# Altium project PowerBoard.PrjPcb
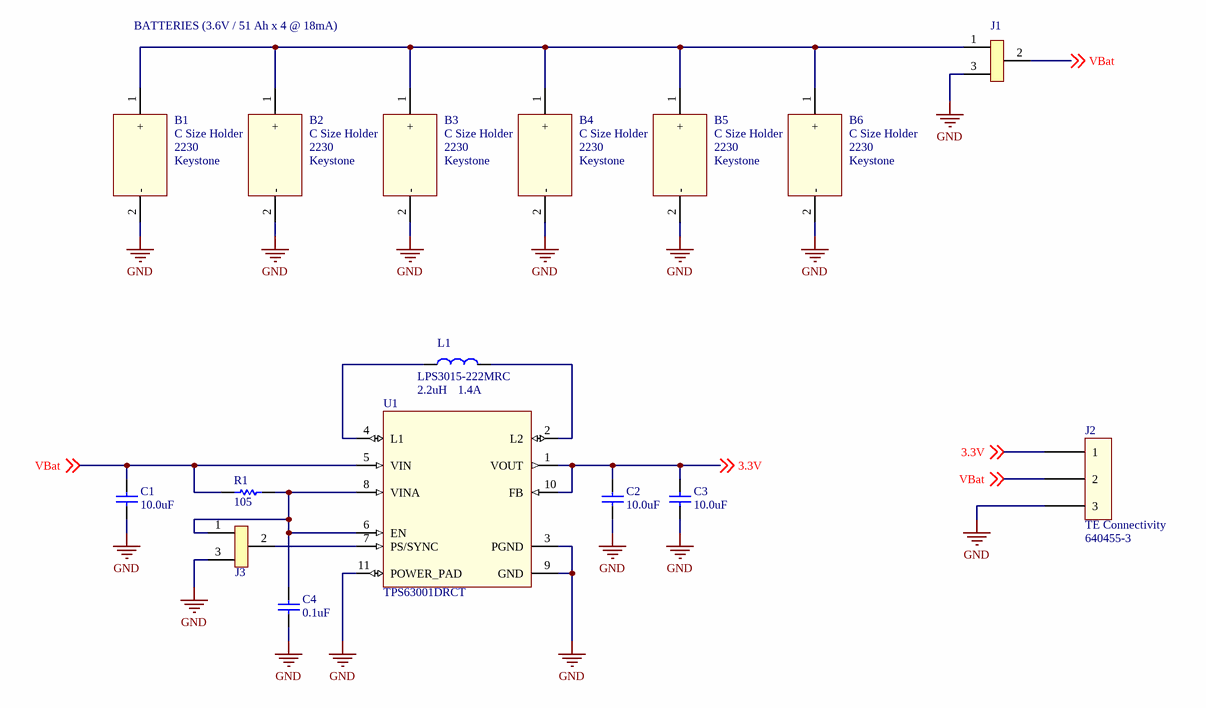
[diagram p0: Power.SchDoc]
1 sheet, 16 parts. Net scope: global (net labels, ports and power ports of the same name join across sheets).
Board file: PowerBoard.PcbDoc

## Sheet Power.SchDoc: POWER
size A4; Author: MOG; CompanyName: GIE GROUP; DrawnBy: MOG; Organization: Gie SA; Address1: Galicia 52; Address2: Mar del Plata; Address3: Buenos Aires; Address4: Argentina; DocumentNumber: 1; Revision: 0.0; SheetNumber: 1; SheetTotal: 1; Project: CP DATALOGGER; PageSetup: Record=PageOptions|CenterHorizontal=True|CenterVertical=True|PrintScale=0.94|XCorrection=1.00|YCorrection=1.00|PrintKind=0|BorderSize=5000000|LeftOffset=0|BottomOffset=0|Orientation=2|PaperLength=1000|PaperWidth=1000|Scale=100|PaperSource=7|PrintQuality=720|MediaType=1|DitherType=10|PaperKind=A4|PrintScaleMode=1

### Parts
B1  value C Size Holder  Manufacturer: Keystone  [KEYSTONE-2230]  (hidden comment: 2230)
B2  value C Size Holder  Manufacturer: Keystone  [KEYSTONE-2230]  (hidden comment: 2230)
B3  value C Size Holder  Manufacturer: Keystone  [KEYSTONE-2230]  (hidden comment: 2230)
B4  value C Size Holder  Manufacturer: Keystone  [KEYSTONE-2230]  (hidden comment: 2230)
B5  value C Size Holder  Manufacturer: Keystone  [KEYSTONE-2230]  (hidden comment: 2230)
B6  value C Size Holder  Manufacturer: Keystone  [KEYSTONE-2230]  (hidden comment: 2230)
C1  value 10.0uF  [CAP-0603]  (hidden comment: C0603C106M9PAC7867)
C2  value 10.0uF  [CAP-0603]  (hidden comment: C0603C106M9PAC7867)
C3  value 10.0uF  [CAP-0603]  (hidden comment: C0603C106M9PAC7867)
C4  value 0.1uF  [CAP-0603]  (hidden comment: C0603C104K5RACAUTO)
J1  PRPC003SAAN-RC  [PIN3]  (value not drawn)
J2  Manufacturer: TE Connectivity  [TE-640455-3]  (hidden comment: 640455-3)
J3  PRPC003SAAN-RC  [PIN3]  (value not drawn)
L1  LPS3015-222MRC  value 2.2uH  Current: 1.4A  [COILCRAFT-LPS3015]
R1  value 105  [RES-0603]  (hidden comment: RC0805FR-07100KL)
U1  TPS63001DRCT  [VSON10]

### Nets
GND: B1.2(-) B2.2(-) B3.2(-) B4.2(-) B5.2(-) B6.2(-) C1.1 C2.1 C3.1 C4.1 J1.3 J2.3 J3.3 U1.3(PGND) U1.9(GND) U1.11(POWER_PAD)
3.3V: C2.2 C3.2 J2.1 U1.1(VOUT) U1.10(FB) ; off-sheet 3.3V
VBat: C1.2 J1.2 J2.2 R1.1 U1.5(VIN) ; off-sheet VBat
NetB1_1: B1.1(+) B2.1(+) B3.1(+) B4.1(+) B5.1(+) B6.1(+) J1.1
NetC4_2: C4.2 J3.1 R1.2 U1.6(EN) U1.8(VINA)
NetJ3_2: J3.2 U1.7(PS/SYNC)
NetL1_1: L1.1 U1.4(L1)
NetL1_2: L1.2 U1.2(L2)

### Notes on the sheet
- BATTERIES (3.6V / 51 Ah x 4 @ 18mA)
- PROYECTO:
- Rev:
- NOMBRE:
- FECHA:
- REALIZO:
- REVISO:
- APROBO:
- PAG:
- HOJA:
- DE
- A4

### Library data of the parts
C1-C3 = C0603C106M9PAC7867: CAP CER 10uF 10V X5R 0603; Manufacturer: Kemet; Tolerance: 20%; Voltage: 10; PartNumber: C0603C106M9PAC7867; Supplier 1: Digi-Key; Supplier 2: Mouser; Supplier Part Number 1: 399-C0603C105M3RAC7867CT-ND; Supplier Part Number 2: 80-C0603C105M3R
C4 = C0603C104K5RACAUTO: CAP CER 0.1uF 50V X7R 0603; Manufacturer: Kemet; Tolerance: 10%; Voltage: 50; PartNumber: C0603C104K5RACAUTO; Supplier 1: Digi-Key; Supplier 2: Mouser; Supplier Part Number 1: 399-6856-1-ND; Supplier Part Number 2: 80-C0603C104K5RAUTO
J1 J3 = PRPC003SAAN-RC: CONN HEADER .100" SNGL STR 3POS; Manufacturer: Sullins Connector Solutions; PartNumber: PRPC003SAAN-RC; Supplier 1: Digi-Key; Supplier Part Number 1: S1011EC-03-ND
J2 = 640455-3: CONN HEADER RTANG 3POS .100 TIN; Mating Conn: 1375820-3; Supplier 1: Digi-Key; Supplier Part Number 1: A19451-ND; Supplier 2: Mouser; Supplier Part Number 2: 571-6404553; PartNumber: 640455-3
L1 = LPS3015-222MRC: 2.2 µH Shielded Inductor 1.4 A 110 mOhm; Manufacturer: Coilcraft; PartNumber: LPS3015-222MRC
R1 = RC0805FR-07105RL: RES SMD 105 OHM 1% 1/8W 0805; Manufacturer: Yageo; Power: 0.125W; Tolerance: 1%; PartNumber: RC0805FR-07100KL; Supplier 1: Digi-Key; Supplier Part Number 1: 311-100KCRCT-ND; Supplier 2: Mouser; Supplier Part Number 2: 603-RC0805FR-07100KL
U1 = TPS63001DRCT: Buck Boost Regulator 3.3V 1.6A 10VSON; Manufacturer: Texas Instruments; PartNumber: TPS63001DRCT
B1-B6 = 2230: PartNumber: 2230